# EAGLE design WELLD0_3Schematic (EAGLE 9.2.0)
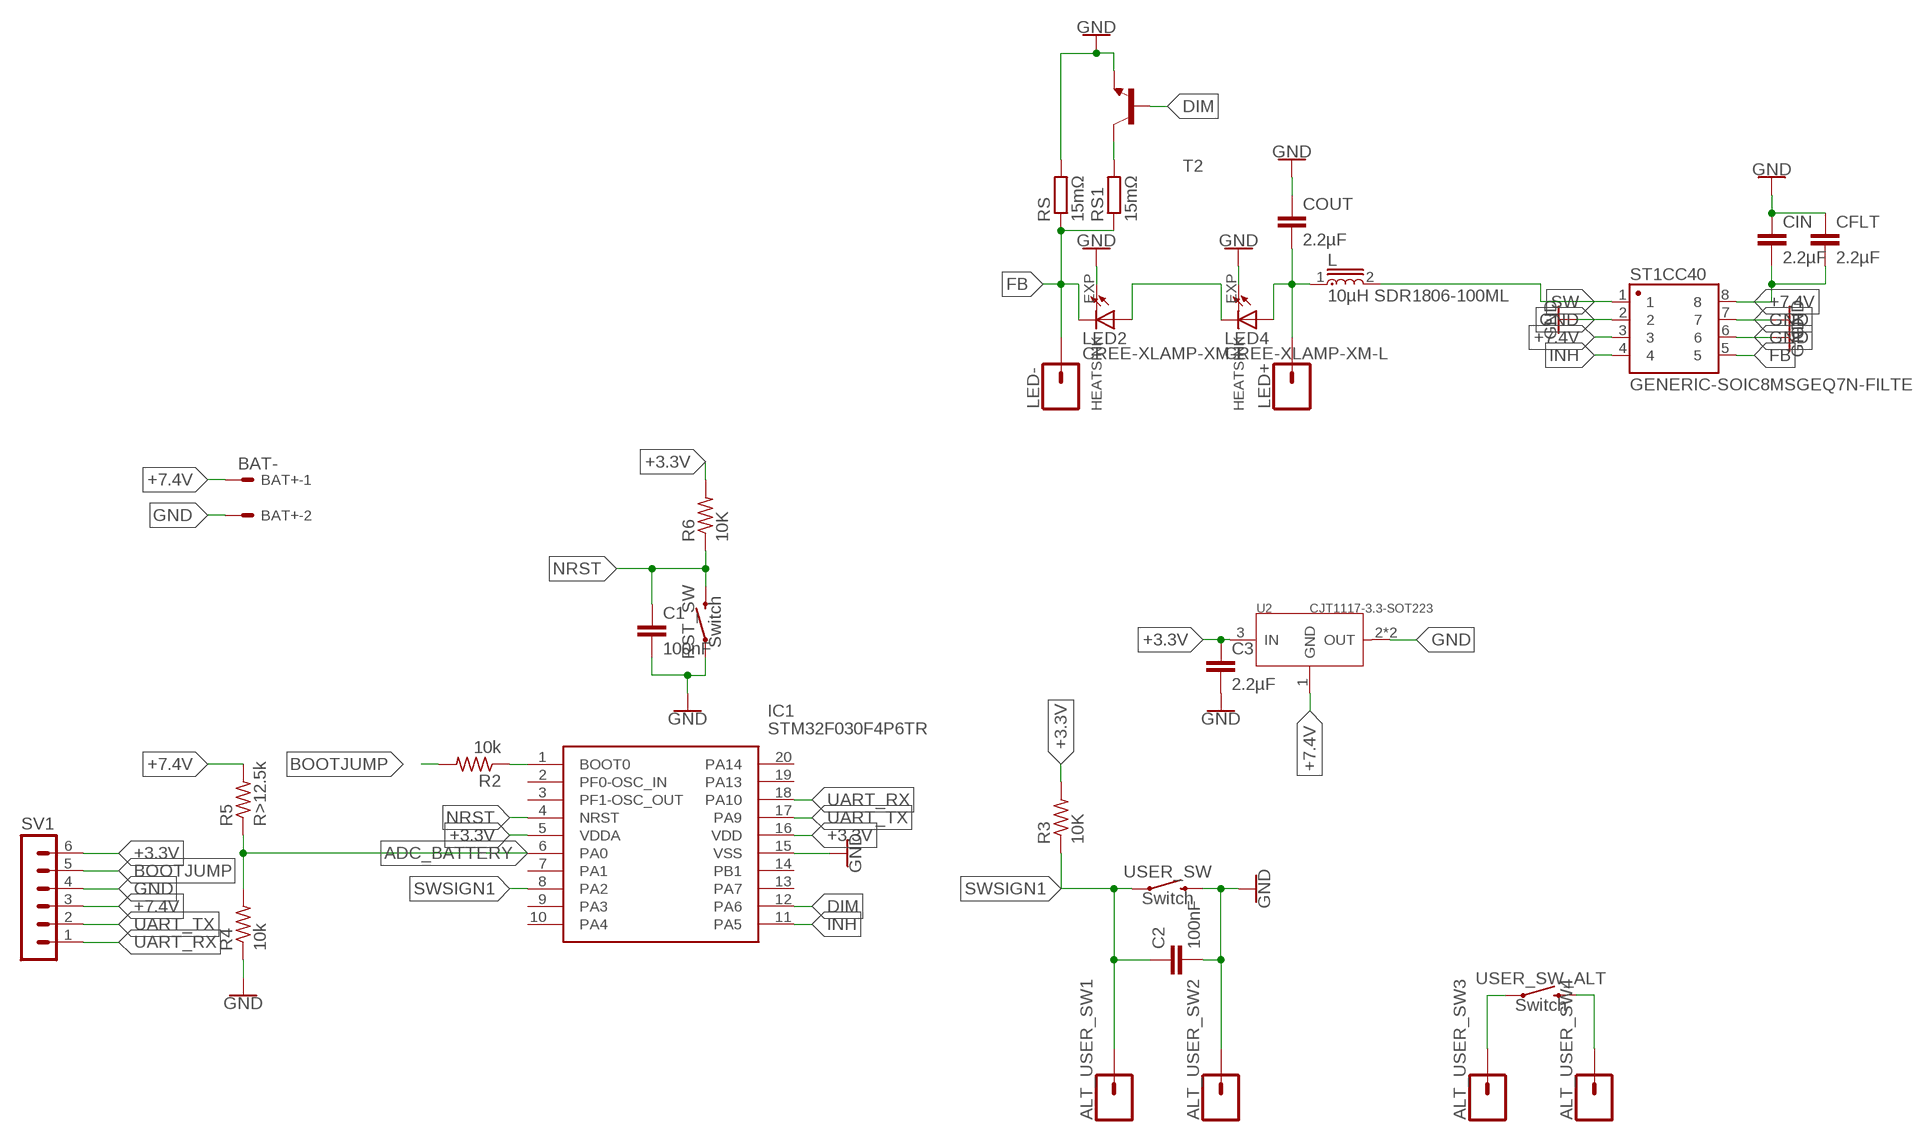
[diagram p0: schematic, sheet 1]

## Parts
ALT_USER_SW1  CONN_01  [1X01]
ALT_USER_SW2  CONN_01  [1X01]
ALT_USER_SW3  CONN_01  [1X01]
ALT_USER_SW4  CONN_01  [1X01]
BAT+  BAT-  22-27-2021-02  [6410-02]
C1  100nF  C-EUC0603  [C0603]
C2  100nF  C-EUC0603  [C0603]
C3  2.2µF  C-EUC0603  [C0603]
CFLT  2.2µF  C-EUC0603  [C0603]
CIN  2.2µF  C-EUC0603  [C0603]
COUT  2.2µF  C-EUC0603  [C0603]
IC1  STM32F030F4P6TR  [SOP65P640X120-20N]
L  10µH SDR1806-100ML  SDR1806-470ML  [INDP1830X1400X690L250X260N]
LED2  CREE-XLAMP-XM-L  [CREE-XLAMP-XM-L]
LED4  CREE-XLAMP-XM-L  [CREE-XLAMP-XM-L]
LED+  CONN_01  [1X01]
LED-  CONN_01  [1X01]
R2  10k  R-US_R0603  [R0603]
R3  10K  R-US_R0603  [R0603]
R4  10k  R-US_R0603  [R0603]
R5  R>12.5k  R-US_R0603  [R0603]
R6  10K  R-US_R0603  [R0603]
RS  15mΩ  R-EU_M1206  [M1206]
RS1  15mΩ  R-EU_M1206  [M1206]
RST_SW  Switch  MOMENTARY-SWITCH-SPST-SMD-6.2MM-TALL  [TACTILE_SWITCH_SMD_6.2MM_TALL]
ST1CC40  GENERIC-SOIC8MSGEQ7N-FILTER  [SO08]
SV1  MA06-1  [MA06-1]
T2  -NPN-SOT23-BEC  [SOT23-BEC]
U2  CJT1117-3.3-SOT223  PMIC-CJT1117-3.3(SOT223)  [SOT-223]
USER_SW  Switch  MOMENTARY-SWITCH-SPST-SMD-6.2MM-TALL  [TACTILE_SWITCH_SMD_6.2MM_TALL]
USER_SW_ALT  Switch  MOMENTARY-SWITCH-SPST-SMD-6.2MM-TALL  [TACTILE_SWITCH_SMD_6.2MM_TALL]

## Nets
+3.3V: C3.1 IC1.5(VDDA) IC1.16(VDD) R3.2 R6.2 SV1.6 U2.3(IN)
+7.4V: BAT+.1 CFLT.2 CIN.2 R5.2 ST1CC40.3 ST1CC40.8 SV1.3 U2.1(GND)
ADC_BATTERY: IC1.6(PA0) R4.2 R5.1
BOOTJUMP: R2.2 SV1.5
DIM: IC1.12(PA6) T2.B
FB: LED2.C LED2.C@1(C) LED-.1 RS1.1 RS.1 ST1CC40.5
GND: ALT_USER_SW2.1 BAT+.2 C1.2 C2.2 C3.2 CFLT.1 CIN.1 COUT.1 IC1.15(VSS) LED2.EXP(HEATSINK) LED4.EXP(HEATSINK) R4.1 RS.2 RST_SW.A2 ST1CC40.2 ST1CC40.6 ST1CC40.7 SV1.4 T2.E U2.2(OUT) U2.TER(OUT) USER_SW.B2
INH: IC1.11(PA5) ST1CC40.4
N$1: COUT.2 L.1 LED4.A LED4.A@1(A) LED+.1
N$2: LED2.A LED2.A@1(A) LED4.C LED4.C@1(C)
N$3: RS1.2 T2.C
N$4: ALT_USER_SW3.1 USER_SW_ALT.A2
N$5: ALT_USER_SW4.1 USER_SW_ALT.B2
N$6: IC1.1(BOOT0) R2.1
NRST: C1.1 IC1.4(NRST) R6.1 RST_SW.B2
SW: L.2 ST1CC40.1
SWSIGN1: ALT_USER_SW1.1 C2.1 IC1.8(PA2) R3.1 USER_SW.A2
UART_RX: IC1.18(PA10) SV1.1
UART_TX: IC1.17(PA9) SV1.2
Unconnected: IC1.2(PF0-OSC_IN) IC1.3(PF1-OSC_OUT) IC1.7(PA1) IC1.9(PA3) IC1.10(PA4) IC1.13(PA7) IC1.14(PB1) IC1.19(PA13) IC1.20(PA14)

## Library data of the parts
ALT_USER_SW1-ALT_USER_SW4 LED+ LED- = SparkFun-Connectors:CONN_01: Single connection point. Often used as Generic Header-pin footprint for 0.1 inch spaced/style header connections On any of the 0.1 inch spaced packages, you can populate with these: Break Away Headers - Straight <https://www.sparkfun.com/products/116> (PRT-00116) Break Away Male Headers - Right Angle <https://www.sparkfun.com/products/553> (PRT-00553) Female Headers <https://www.sparkfun.com/products/115> (PRT-00115) Break Away Headers - Machine Pin <https://www.sparkfun.com/products/117> (PRT-00117) Break Away Female Headers - Swiss Machine Pin <https://www.sparkfun.com/products/743> (PRT-00743) This device is also useful as a general connection point to wire up your design to another part of your project. Our various solder wires solder well into these plated through hole pads. Hook-Up Wire - Assortment (Stranded, 22 AWG) <https://www.sparkfun.com/products/11375> (PRT-11375) Hook-Up Wire - Assortment (Solid Core, 22 AWG) <https://www.sparkfun.com/products/11367> (PRT-11367) View the entire wire category on our website here <https://www.sparkfun.com/categories/141> Special notes: SMTSO-256-ET is a "flush mount" nut for a 4-40 screw. We mostly use this on specialty testbeds; it is a nice way to connect hardware to your PCB at an adjustable hieght. Also note, the SNAP packages are for using a snappable style connector. We sell a baggie of snaps and they are also used on two LilyPad designs: Snap Assortment - 30 pack (male and female) <https://www.sparkfun.com/products/11347> (DEV-11347) LilyPad Arduino SimpleSnap <https://www.sparkfun.com/products/10941> (DEV-10941) LilyPad SimpleSnap Protoboard <https://www.sparkfun.com/products/10940> (DEV-10940)
BAT+ = con-molex:22-?-02: CONNECTOR wire to board 2.54 mm (.1 inch) pitch header; MF: MOLEX; OC_FARNELL: unknown; OC_NEWARK: unknown
C1-C3 CFLT CIN COUT = rcl:C-EU: CAPACITOR, European symbol; SPICEPREFIX: C
IC1 = SamacSys_Parts:STM32F030F4P6TR: 32-Bit MCU Cortex-M0 16K Flash TSSOP20 32-Bit MCU Cortex-M0 16K Flash TSSOP20 Source: Datasheet <http://www.st.com/web/en/resource/technical/document/datasheet/DM00088500.pdf>; ALLIED_NUMBER: 70521133; ALLIED_PRICE-STOCK: http://www.alliedelec.com/stmicroelectronics-stm32f030f4p6tr/70521133/; ARROW_PART_NUMBER: STM32F030F4P6TR; ARROW_PRICE-STOCK: https://www.arrow.com/en/products/stm32f030f4p6tr/stmicroelectronics; DESCRIPTION: 32-Bit MCU Cortex-M0 16K Flash TSSOP20 32-Bit MCU Cortex-M0 16K Flash TSSOP20; HEIGHT: 1.2mm; MANUFACTURER_NAME: STMicroelectronics; MANUFACTURER_PART_NUMBER: STM32F030F4P6TR; RS_PART_NUMBER: 1688744; RS_PRICE-STOCK: http://uk.rs-online.com/web/p/products/1688744
L = SDR1806-470ML:SDR1806-470ML: Inductor Power Wirewound 100uH 10% 100KHz 25Q-Factor Ferrite 1.7A 190mOhm DCR T/R; DESCRIPTION: Inductor Power Wirewound 47uH 20% 100KHz 22Q-Factor Ferrite 2.5A 95mOhm DCR T/R; DIGI-KEY_PART_NUMBER: SDR1806-470MLCT-ND; DIGI-KEY_PURCHASE_URL: https://www.digikey.dk/product-detail/en/bourns-inc/SDR1806-470ML/SDR1806-470MLCT-ND/2127238?utm_source=snapeda&utm_medium=aggregator&utm_campaign=symbol; MF: Bourns; MP: SDR1806-470ML; PACKAGE: Nonstandard Bourns
LED2 LED4 = led1:CREE-XLAMP-XM-L: Cree® XLamp® XM-L LEDs Source: http://www.cree.com
R2-R6 = audio amplifier example:R-US_: RESISTOR, American symbol
RS RS1 = rcl:R-EU_: RESISTOR, European symbol; SPICEPREFIX: R
RST_SW USER_SW USER_SW_ALT = SparkFun-Switches:MOMENTARY-SWITCH-SPST: Momentary Switch (Pushbutton) - SPST Normally-open (NO) SPST momentary switches (buttons, pushbuttons). Variants PTH-12MM - 12mm square, through-hole Momentary Pushbutton Switch - 12mm Square <https://www.sparkfun.com/products/9190> (COM-09190) PTH-6.0MM, PTH-6.0MM-KIT - 6.0mm square, through-hole Mini Pushbutton Switch <https://www.sparkfun.com/products/97> (COM-00097) KIT package intended for soldering kit's - only one side of pads' copper is exposed. PTH-RIGHT-ANGLE-KIT - Right-angle, through-hole Right Angle Tactile Button <https://www.sparkfun.com/products/10791> - Used on SparkFun BigTime Watch Kit <https://www.sparkfun.com/products/11734> SMD-12MM - 12mm square, surface-mount Tactile Button - SMD (12mm) <https://www.sparkfun.com/products/12993> (COM-12993) Used on SparkFun PicoBoard <https://www.sparkfun.com/products/11888> SMD-4.5MM - 4.5mm Square Trackball Switch Used on SparkFun Blackberry Trackballer Breakout <https://www.sparkfun.com/products/13169> SMD-4.6MMX2.8MM - 4.60mm x 2.80mm, surface mount Used on SparkFun SAMD21 Mini Breakout <https://www.sparkfun.com/products/13664> SMD-5.2MM, SMD-5.2-REDUNDANT - 5.2mm square, surface-mount Mini Pushbutton Switch - SMD <https://www.sparkfun.com/products/8720> (COM-08720) Used on Arduino Pro Mini <https://www.sparkfun.com/products/11114> REDUNDANT package connects both switch circuits together SMD-6.0X3.5MM - 6.0 x 3.5mm, surface mount Momentary Reset Switch SMD <https://www.sparkfun.com/products/8229> (COM-08229) SMD-6.2MM-TALL - 6.2mm square, surface mount Tactile Button - SMD (6mm) <https://www.sparkfun.com/products/12992> Used on SparkFun Digital Sandbox <https://www.sparkfun.com/products/12651> SMD-RIGHT-ANGLE - Right-angle, surface mount Used on SparkFun Block for Intel® Edison - Arduino <https://www.sparkfun.com/products/13036>; PROD_ID: SWCH-11966; SF_SKU: COM-12992
ST1CC40 = SparkFun-Retired:GENERIC-SOIC8: A placeholder for generic narrow & wide SOIC8 foorptints - used on the DIP adapter board. Has strange reference to IC-10141, a Seven Band Graphic Equalizer Display Filter SOIC-8 VFP: IC-10141; PROD_ID: IC-10141
SV1 = con-lstb:MA06-1: PIN HEADER; OC_FARNELL: unknown; OC_NEWARK: unknown
T2 = DC_LOAD_AU:*-NPN-: NPN Transistror BF959 corrected 2008.03.06
U2 = Seeed-IC:PMIC-CJT1117-3.3(SOT223): 310030097; MPN: CJT1117-3.3

## Board
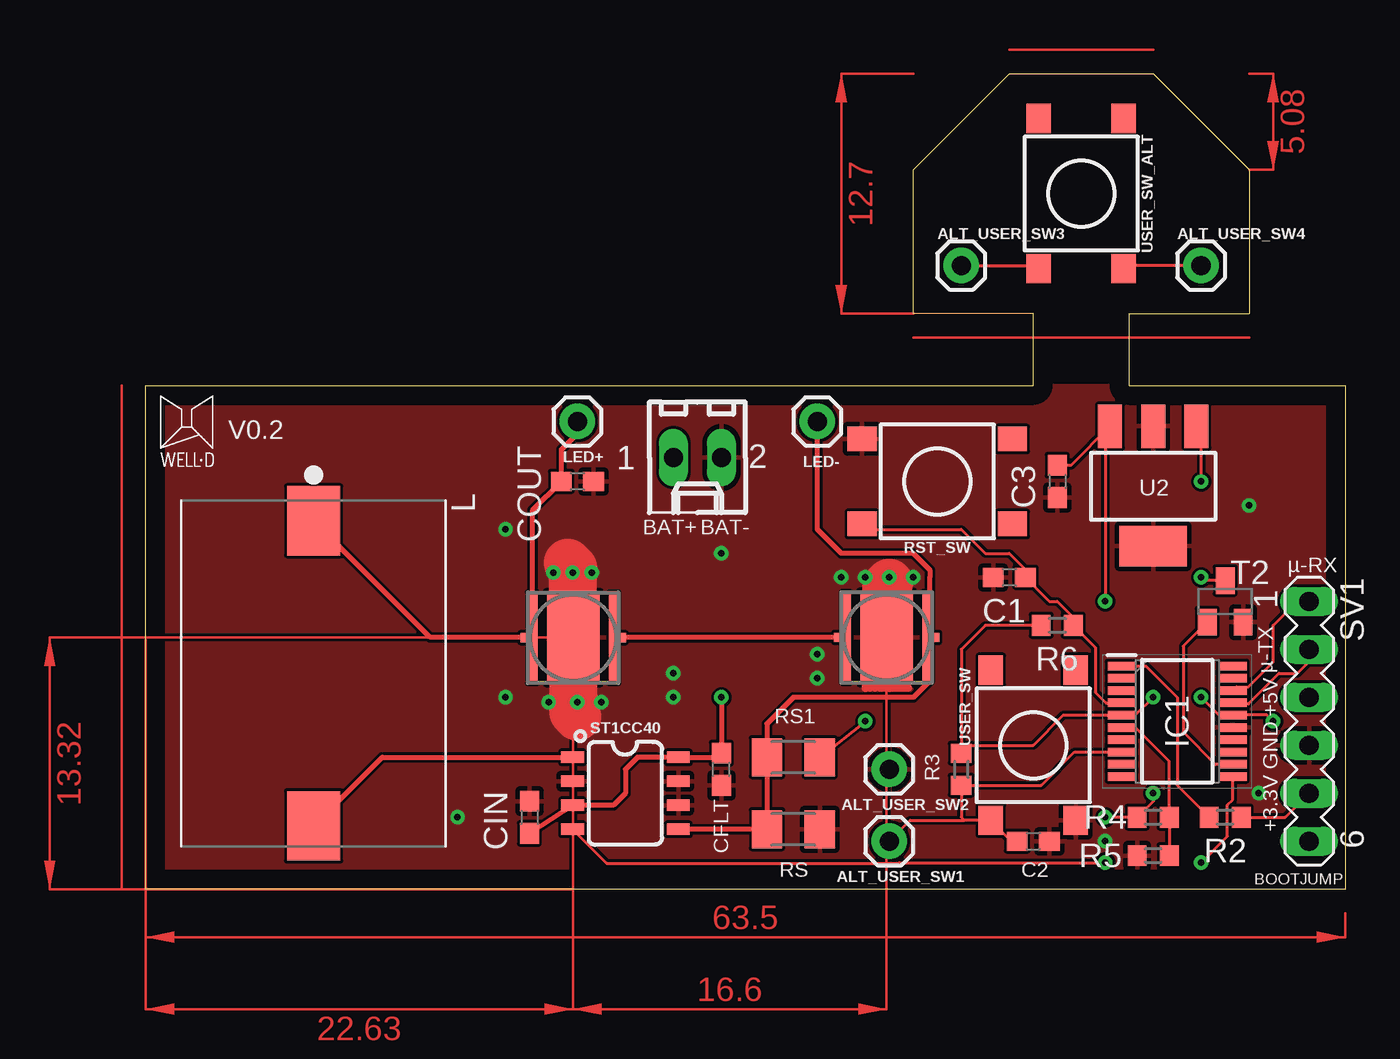
[diagram p1: board, top side]
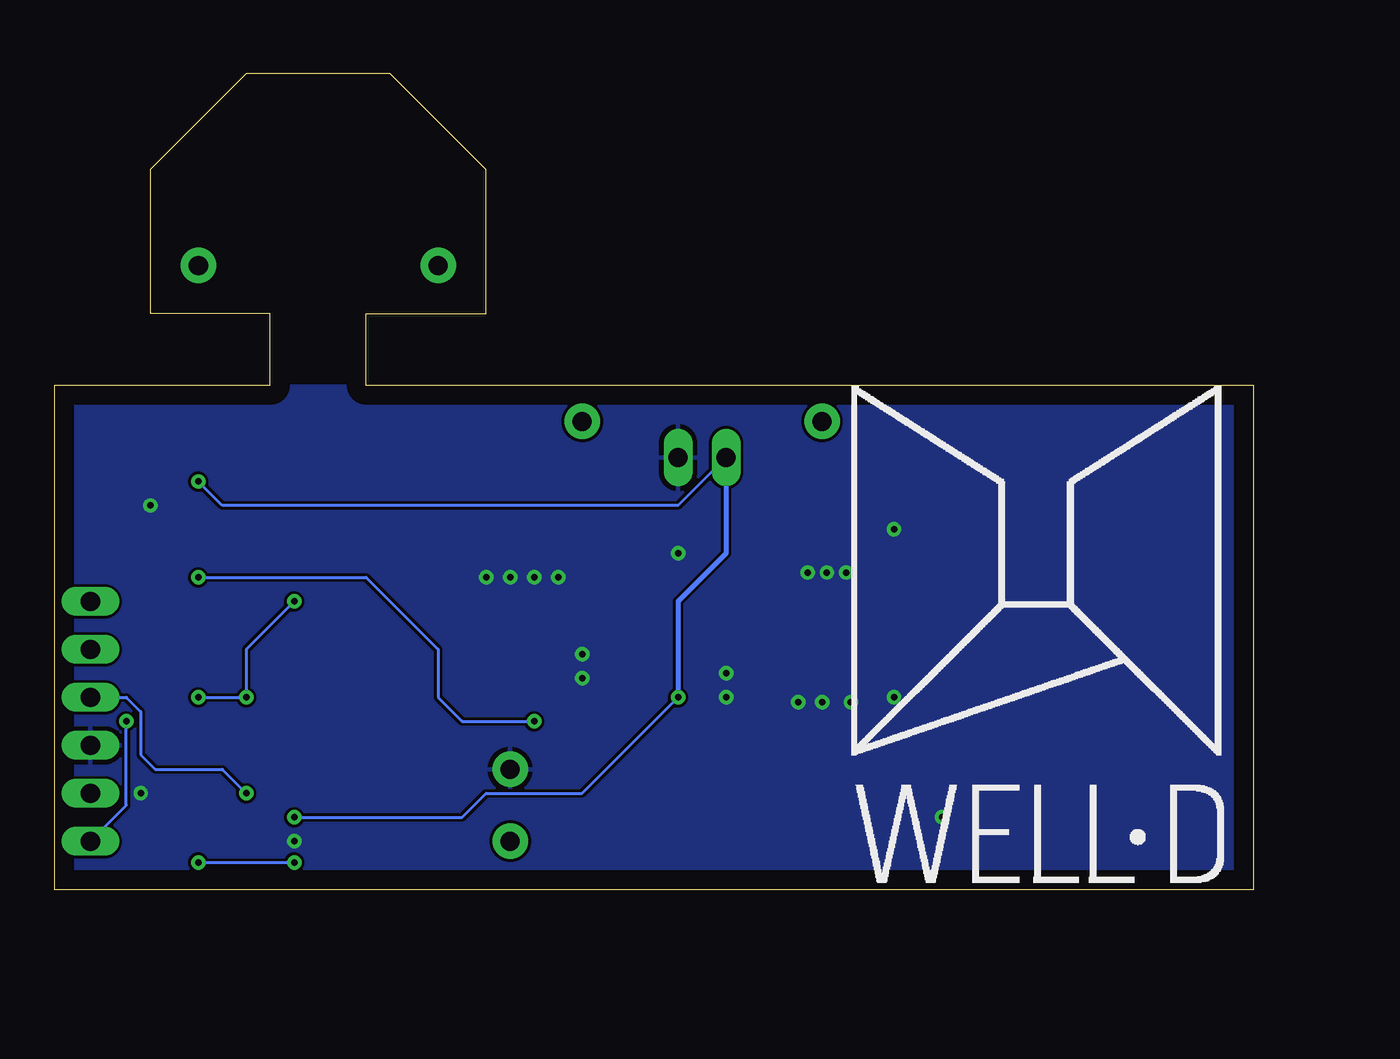
[diagram p2: board, bottom side, seen from below]

Size 63.5 x 43.18 mm. Coordinates in mm from the lower left corner, seen from the top.
Outline: 0,0 0,26.67 46.99,26.67 46.99,30.48 40.64,30.48 40.64,38.1 45.72,43.18 53.34,43.18 58.42,38.1 58.42,30.48 52.07,30.48 52.07,26.67 63.5,26.67 63.5,0 0,0
Copper layers (1*16): Top 0.035mm / dielectric 1.5mm / Bottom 0.035mm
Design rules "default": minimum track width 6mil, minimum drill 0.35mm, track to track 6mil, track to pad 6mil, pad to pad 6mil, via to via 6mil, smd to smd 6mil, copper to edge 40mil, drill to drill 6mil, minimum pad ring 10mil, minimum via ring 8mil, stop-mask expansion 4mil, vias tented up to drill 0mil, thermal gap 10mil

### Footprints (pad centres in the part's own frame; a part is rotated, then mirrored left to right if it is on the bottom)
1X01 = drill 1.016 pad 1.88: 1 0,0
6410-02 = drill 1.016 long: 1 1.27,0; 2 -1.27,0
C0603 = smd 1.1 x 1: 1 -0.85,0; 2 0.85,0
SOP65P640X120-20N = smd 1.475 x 0.45: 1 -2.938,2.925; 2 -2.938,2.275; 3 -2.938,1.625; 4 -2.938,0.975; 5 -2.938,0.325; 6 -2.938,-0.325; 7 -2.938,-0.975; 8 -2.938,-1.625; 9 -2.938,-2.275; 10 -2.938,-2.925; 11 2.938,-2.925; 12 2.938,-2.275; 13 2.938,-1.625; 14 2.938,-0.975; 15 2.938,-0.325; 16 2.938,0.325; 17 2.938,0.975; 18 2.938,1.625; 19 2.938,2.275; 20 2.938,2.925
INDP1830X1400X690L250X260N = smd 3.67 x 2.82: 1 -8.075,0; 2 8.075,0
CREE-XLAMP-XM-L = smd 0.5 x 4.8: A 2.141,0; C -2.141,0 | smd 0.5 x 0.5: A@1 2.54,0; C@1 -2.54,0 | smd 2.782 x 4.8: EXP 0,0
R0603 = smd 1 x 1.1: 1 -0.85,0; 2 0.85,0
M1206 = smd 1.6 x 2: 1 -1.4,0; 2 1.4,0
TACTILE_SWITCH_SMD_6.2MM_TALL = smd 1.55 x 1.3: A1 -3.975,-2.25; A2 3.975,-2.25; B1 -3.975,2.25; B2 3.975,2.25
SO08 = smd 0.6 x 1.2: 1 -1.905,-2.8; 2 -0.635,-2.8; 3 0.635,-2.8; 4 1.905,-2.8; 5 1.905,2.8; 6 0.635,2.8; 7 -0.635,2.8; 8 -1.905,2.8
MA06-1 = drill 1.016 long: 1 -6.35,0; 2 -3.81,0; 3 -1.27,0; 4 1.27,0; 5 3.81,0; 6 6.35,0
SOT23-BEC = smd 1 x 1.4: B -0.95,-1.1; C 0,1.1; E 0.95,-1.1
SOT-223 = smd 1.27 x 2.286: 1 -2.286,-3.175; 2 0,-3.175; 3 2.286,-3.175 | smd 3.556 x 2.159: TER 0,3.175

### Placement (x,y rotation side)
ALT_USER_SW1  39.37,2.54 0 top
ALT_USER_SW2  39.37,6.35 0 top
ALT_USER_SW3  43.18,33.02 0 top
ALT_USER_SW4  55.88,33.02 0 top
BAT+  29.21,22.86 180 top
C1  45.72,16.51 180 top
C2  46.99,2.54 0 top
C3  48.26,21.59 270 top
CFLT  30.48,6.35 90 top
CIN  20.32,3.81 270 top
COUT  22.86,21.59 180 top
IC1  54.61,8.89 0 top
L  8.89,11.43 270 top
LED2  39.23,13.33 180 top
LED4  22.63,13.32 180 top
LED+  22.86,24.77 0 top
LED-  35.56,24.77 0 top
R2  57.15,3.81 0 top
R3  43.18,6.35 90 top
R4  53.34,1.78 0 top
R5  53.34,3.81 180 top
R6  48.26,13.97 180 top
RS  34.29,3.17 0 top
RS1  34.29,6.99 0 top
RST_SW  41.91,21.59 180 top
ST1CC40  25.4,5.08 270 top
SV1  61.59,8.89 270 top
T2  57.15,15.24 0 top
U2  53.34,21.34 180 top
USER_SW  46.99,7.62 270 top
USER_SW_ALT  49.53,36.83 270 top

### Tracks (layer width: path | path; a pad name or v marks a point on that pad's centre or on a via)
+3.3V  (via drill 0.35 pad 0.55)
  Top 0.152: v50.8,15.24 50.8,24.26 U2.3 48.98,22.44 C3.1 | v53.34,10.16 52.4,9.21 IC1.5 48.59,9.21 46.99,7.62 43.6,7.62 R3.2 43.18,12.7 44.45,13.97 R6.2 | v59.69,8.89 59.37,9.21 IC1.16 56.83,9.21 v55.88,10.16
  Bottom 0.152: v50.8,15.24 53.34,12.7 v53.34,10.16 v55.88,10.16 | SV1.6 59.69,4.45 v59.69,8.89
+7.4V  (via drill 0.35 pad 0.55)
  Top 0.152: v53.34,5.08 53.34,4.66 R5.2 v50.8,3.81 | U2.1 55.88,24.26 55.88,24.13 v55.88,21.59
  Top 0.254: CIN.2 ST1CC40.3 24.77,4.45 25.4,5.08 25.4,6.35 26.04,6.99 ST1CC40.8 30.27,6.99 CFLT.2 v30.48,10.16
  Bottom 0.152: SV1.3 59.69,10.16 58.93,9.4 58.93,7.11 58.17,6.35 54.61,6.35 v53.34,5.08 | v50.8,3.81 41.91,3.81 40.64,5.08 35.56,5.08 v30.48,10.16 | BAT+.1 30.48,20.32 54.61,20.32 v55.88,21.59
  Bottom 0.254: BAT+.1 27.94,17.78 30.48,15.24 v30.48,10.16
ADC_BATTERY
  Top 0.152: R4.2 R5.1 54.19,6.77 52.32,8.64 52.25,8.56 IC1.6
BOOTJUMP
  Top 0.152: R2.2 60.33,3.81 SV1.5
DIM
  Top 0.152: T2.B 54.93,12.87 54.93,8.32 56.64,6.6 57.15,6.6 57.16,6.62 IC1.12
FB
  Top 0.254: LED-.1 35.56,19.05 36.83,17.78 40.64,17.78 41.51,16.91 41.51,16.51 41.51,13.59 | ST1CC40.5 RS.1 RS1.1 32.89,8.76 34.29,10.16 40.64,10.16 41.51,11.03 41.51,13.19 LED2.C 41.51,13.47 41.51,13.59 | LED2.C@1 41.51,13.59
GND  (via drill 0.35)
  Top 0.254: LED4.EXP 22.63,11.2 21.59,10.16
  Top 0.406: 38.1,11.43 38.1,12.2 LED2.EXP 39.23,11.32 39.88,10.67 40.13,10.92 | 38.1,10.92 38.1,10.64 | 38.1,11.43 38.35,11.18 | 38.35,11.18 38.35,10.67 38.1,10.92 | 38.1,10.92 38.1,11.43 | 38.35,11.18 38.61,10.92 38.61,10.67 38.73,10.79 | 38.73,10.79 39.37,11.43 39.37,10.64 | 40.13,11.18 40.13,10.92 | 40.13,10.92 40.39,10.67 38.86,10.67 38.73,10.79
  Top 2.54: 22.35,17.27 22.63,16.99 LED4.EXP 22.63,9.37 22.86,9.14 | LED2.EXP 39.23,16.09 39.37,16.23
  other vias: 27.94,10.16 58.93,5.08 30.48,17.78 19.05,10.16 16.51,3.81 19.05,19.05 58.42,20.32 27.94,11.43 50.8,2.54 38.1,16.51 39.37,16.51 40.64,16.51 36.83,16.51 35.56,12.45 35.56,11.18 22.86,9.91 24.13,9.91 21.34,9.91 21.59,16.76 23.62,16.76 22.61,16.76
  pour Top: 0,26.67 0,0 63.5,0 63.5,26.67
  pour Bottom: 0,26.67 0,0 63.5,0 63.5,26.67
INH  (via drill 0.35 pad 0.55)
  Top 0.152: v50.8,1.41 39.89,1.41 39.85,1.37 24.4,1.37 ST1CC40.4 | v55.88,1.41 57.27,2.8 57.27,4.46 57.55,4.73 IC1.11
  Bottom 0.152: v50.8,1.41 v55.88,1.41
N$1
  Top 0.254: 20.32,13.34 20.07,13.34 | L.1 15.06,13.34 19.05,13.34 20.07,13.34 | LED+.1 22.86,24.13 22.01,23.28 COUT.2 20.49,20.07 LED4.A 20.47,13.34 20.07,13.34 | LED4.A@1 20.07,13.34
N$2
  Top 0.254: LED4.C LED4.C@1 25.39,13.32 25.4,13.33 LED2.A LED2.A@1
N$3  (via drill 0.35 pad 0.55)
  Top 0.152: T2.C 56.05,16.34 v55.88,16.51 | v38.1,8.89 RS1.2
  Bottom 0.152: v55.88,16.51 46.99,16.51 43.18,12.7 43.18,10.16 41.91,8.89 v38.1,8.89
N$4
  Top 0.152: ALT_USER_SW3.1 47.12,33.02 USER_SW_ALT.A2
N$5
  Top 0.152: ALT_USER_SW4.1 51.95,33.02 USER_SW_ALT.B2
N$6
  Top 0.152: IC1.1 52.95,11.81 54.61,10.16 54.61,5.5 R2.1
NRST
  Top 0.152: RST_SW.B2 38.23,19.05 43.18,19.05 44.45,17.78 45.72,17.78 46.57,16.93 C1.1 47.84,15.24 48.26,15.24 49.11,14.39 R6.1 50.29,12.79 50.29,10.41 50.84,9.87 IC1.4
SW
  Top 0.254: L.2 12.52,6.99 ST1CC40.1
SWSIGN1
  Top 0.152: C2.1 45.84,2.54 USER_SW.A2 43.34,3.65 | 43.34,3.65 43.18,3.81 R3.1 47.41,5.5 49.17,7.26 IC1.8 | ALT_USER_SW1.1 40.48,3.65 43.34,3.65
UART_RX
  Top 0.152: IC1.18 57.74,10.71 58.38,10.71 59.69,12.02 59.69,13.97 60.96,15.24 SV1.1
UART_TX
  Top 0.152: IC1.17 57.61,9.81 58.38,9.81 60,11.43 60.96,11.43 61.59,12.06 SV1.2
(copper drawn outside any net)
  shapes: Top area x9

### Text on the board
tNames: V0.2 | µ-RX | µ-TX | +5V | GND | +3.3V | BOOTJUMP